# Altium schematic sheet Buck_converter.SchDoc: Buck Sinc Converter
size A4; Organization: UDESC; Revision: R0; SheetNumber: 1; SheetTotal: 10
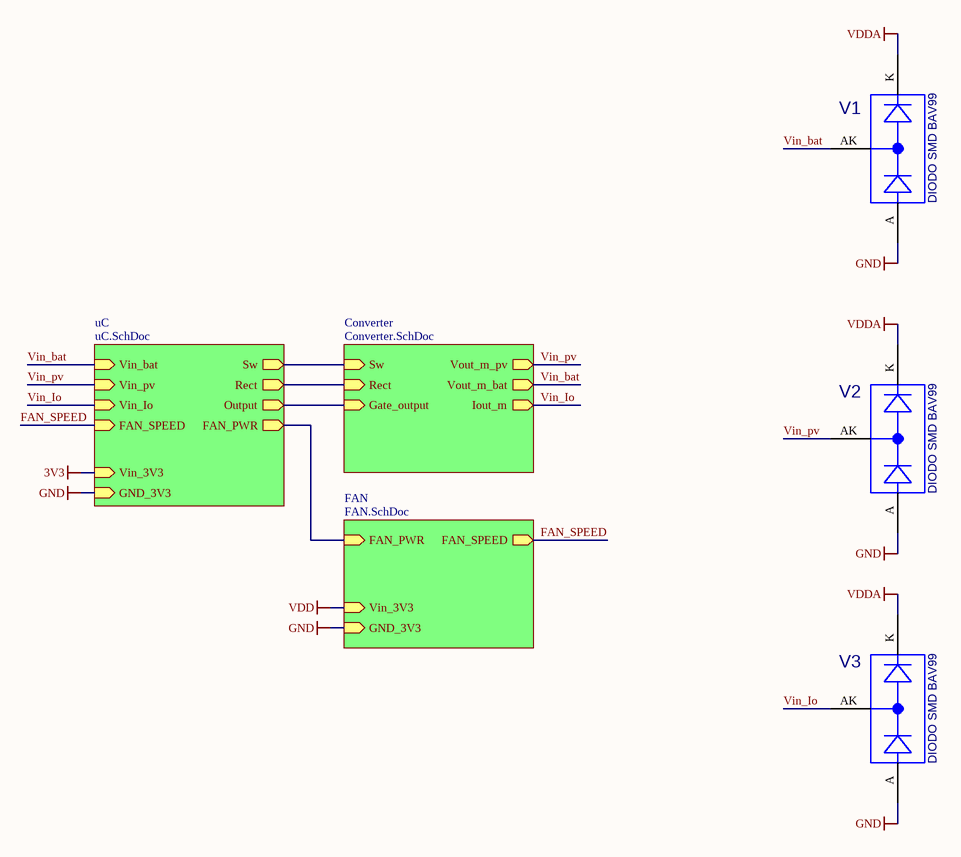
[diagram p0: Buck_converter.SchDoc]

## Parts
V1  value DIODO SMD BAV99  [SOT23-BAV99A]  (hidden comment: 10574587)
V2  value DIODO SMD BAV99  [SOT23-BAV99A]  (hidden comment: 10574587)
V3  value DIODO SMD BAV99  [SOT23-BAV99A]  (hidden comment: 10574587)

## Sub-sheets
Converter = Converter.SchDoc: Sw (in), Rect (in), Vout_m_pv (out), Vout_m_bat (out), Iout_m (out), Gate_output (in)
FAN = FAN.SchDoc: FAN_PWR (in), GND_3V3 (in), FAN_SPEED (out), Vin_3V3 (in)
uC = uC.SchDoc: Vin_3V3 (in), GND_3V3 (in), Sw (out), Rect (out), Vin_bat (in), Vin_pv (in), Vin_Io (in), Output (out), FAN_SPEED (in), FAN_PWR (out)

## Nets
3V3: sheet uC/Vin_3V3
GND: V1.A V2.A V3.A ; sheet uC/GND_3V3, sheet FAN/GND_3V3
VDD: sheet FAN/Vin_3V3
VDDA: V1.K V2.K V3.K
FAN_SPEED: sheet uC/FAN_SPEED, sheet FAN/FAN_SPEED
Vin_bat: V1.AK ; sheet uC/Vin_bat, sheet Converter/Vout_m_bat
Vin_Io: V3.AK ; sheet uC/Vin_Io, sheet Converter/Iout_m
Vin_pv: V2.AK ; sheet uC/Vin_pv, sheet Converter/Vout_m_pv
(unnamed): sheet uC/Sw, sheet Converter/Sw
(unnamed): sheet uC/Rect, sheet Converter/Rect
(unnamed): sheet uC/Output, sheet Converter/Gate_output
(unnamed): sheet uC/FAN_PWR, sheet FAN/FAN_PWR

## Notes on the sheet
- Title
- Size:
- Date:
- A4
- Number:
- Time:
- Revision:
- Sheet
- of
- File:

## Library data of the parts
V1-V3 = DIODO BAS40: DIODO SMD BAV99; HISitem: Criado em 06/04/15 (p/ Ricardo); PN: 10574587; PMT: SMD; ComponentLink1URL: http://www.onsemi.com/pub_link/Collateral/BAS40-04LT1-D.PDF